# EAGLE design main (EAGLE 6.4)

## Sheet 1 of 2
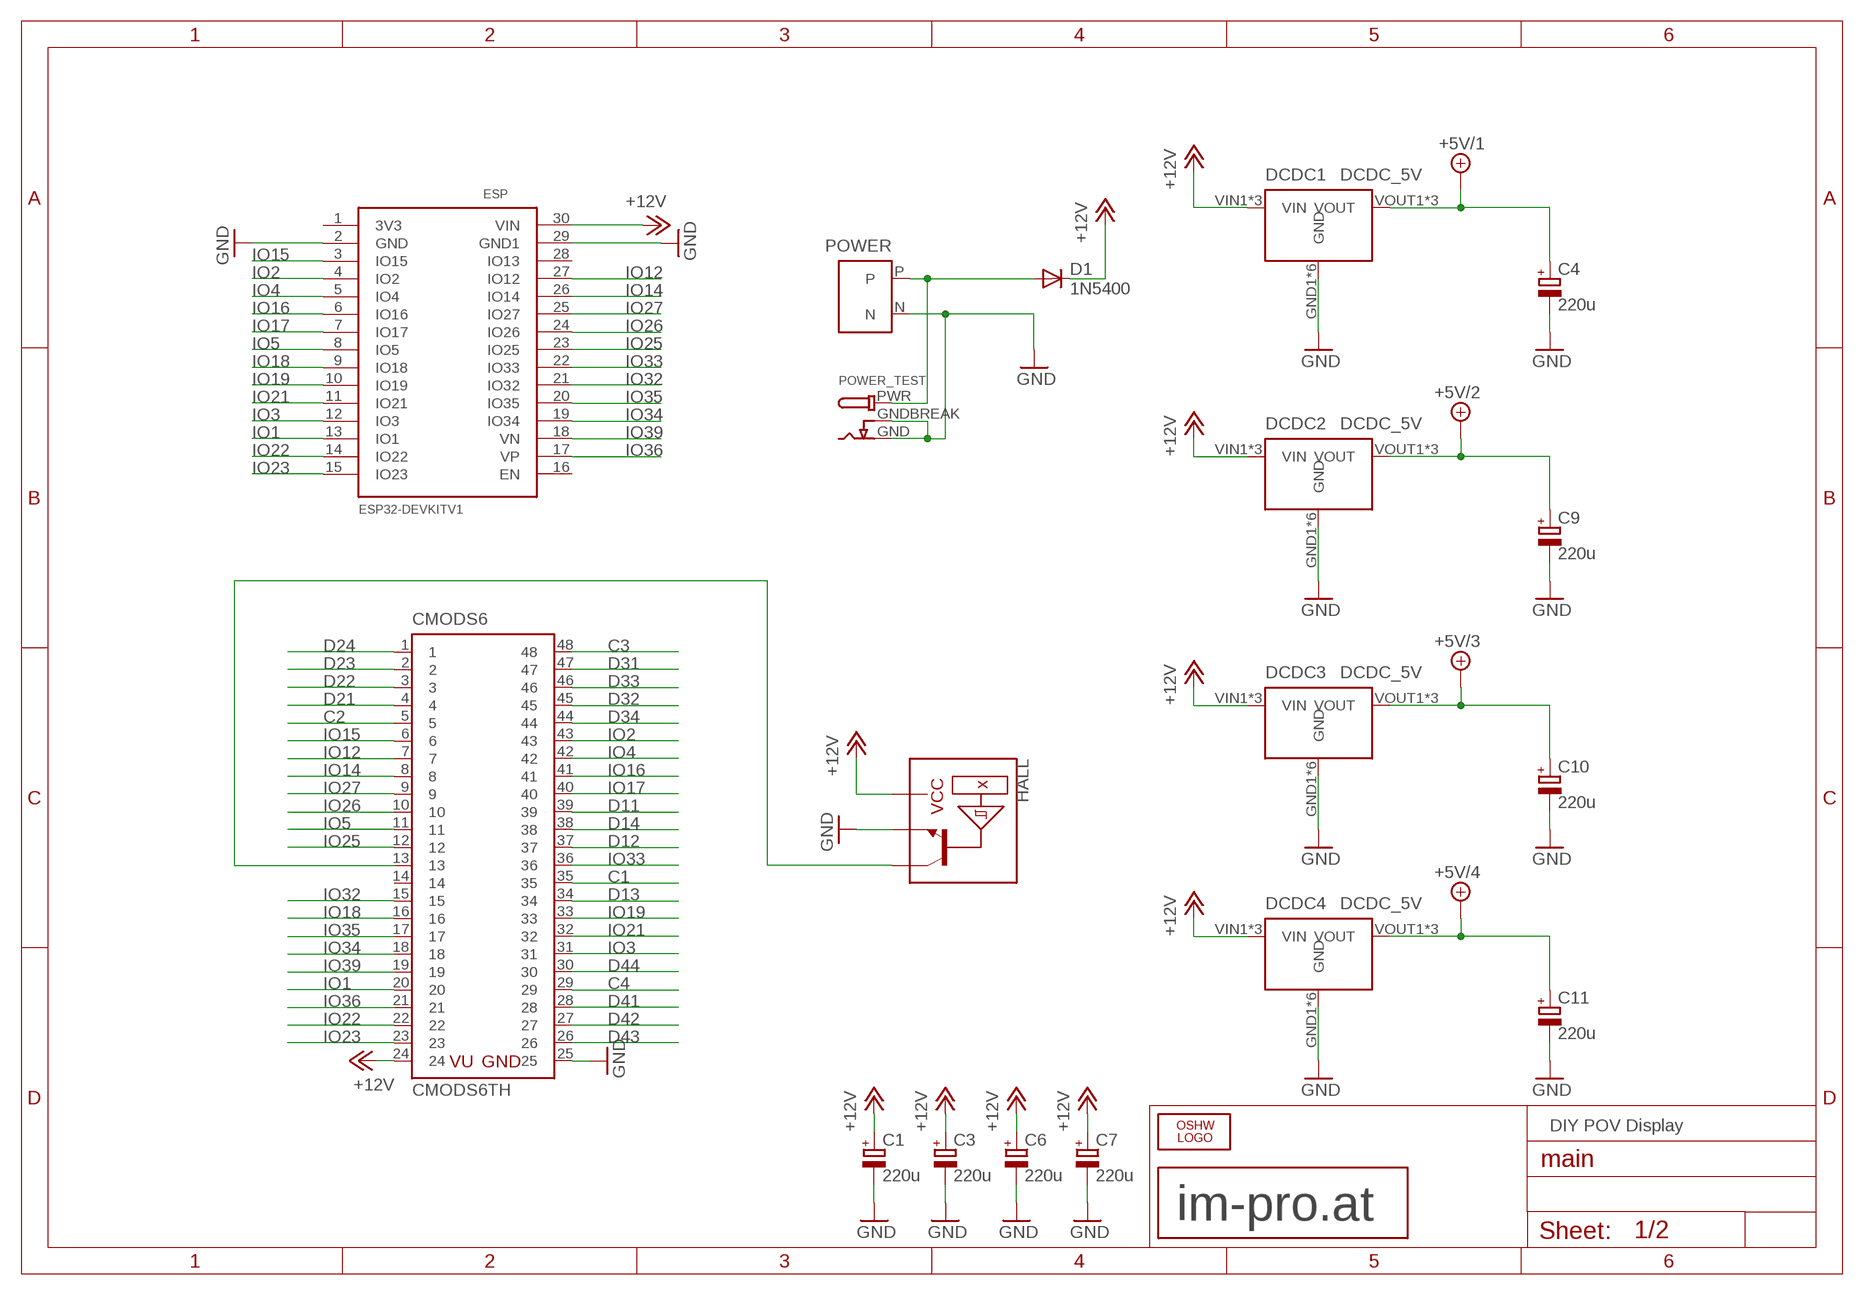
[diagram p0: schematic, sheet 1]

### Parts
C1  220u  CPOL-EUE3.5-8  [E3,5-8]
C3  220u  CPOL-EUE3.5-8  [E3,5-8]
C4  220u  CPOL-EUE3.5-8  [E3,5-8]
C6  220u  CPOL-EUE3.5-8  [E3,5-8]
C7  220u  CPOL-EUE3.5-8  [E3,5-8]
C9  220u  CPOL-EUE3.5-8  [E3,5-8]
C10  220u  CPOL-EUE3.5-8  [E3,5-8]
C11  220u  CPOL-EUE3.5-8  [E3,5-8]
CMODS6  CMODS6TH  [DIL48]
D1  1N5400  [DO201-15]
DCDC1  DCDC_5V  [DCDC]
DCDC2  DCDC_5V  [DCDC]
DCDC3  DCDC_5V  [DCDC]
DCDC4  DCDC_5V  [DCDC]
ESP  ESP32DEVKITV1  [ESP32-DEVKITV1]
HALL  HALL  [HALL]
LOGO1  OSHW_LOGO_FILLX0350-NT  [OSHW_FILLX350_NOTEXT]
POWER  TX30  [XT30]
POWER_TEST  DCBARRELPTH  [DCJACK_2MM_PTH]
U$2  LOGO20MM  [LOGO_20MM]

### Nets
+5V/1: C4.+ DCDC1.VOUT1(VOUT) DCDC1.VOUT2(VOUT) DCDC1.VOUT3(VOUT) ; also sheet 2
+5V/2: C9.+ DCDC2.VOUT1(VOUT) DCDC2.VOUT2(VOUT) DCDC2.VOUT3(VOUT) ; also sheet 2
+5V/3: C10.+ DCDC3.VOUT1(VOUT) DCDC3.VOUT2(VOUT) DCDC3.VOUT3(VOUT) ; also sheet 2
+5V/4: C11.+ DCDC4.VOUT1(VOUT) DCDC4.VOUT2(VOUT) DCDC4.VOUT3(VOUT) ; also sheet 2
+12V: C1.+ C3.+ C6.+ C7.+ CMODS6.24 D1.C DCDC1.VIN1(VIN) DCDC1.VIN2(VIN) DCDC1.VIN3(VIN) DCDC2.VIN1(VIN) DCDC2.VIN2(VIN) DCDC2.VIN3(VIN) DCDC3.VIN1(VIN) DCDC3.VIN2(VIN) DCDC3.VIN3(VIN) DCDC4.VIN1(VIN) DCDC4.VIN2(VIN) DCDC4.VIN3(VIN) ESP.30(VIN) HALL.VCC
C1: CMODS6.35 ; also sheet 2
C2: CMODS6.5 ; also sheet 2
C3: CMODS6.48 ; also sheet 2
C4: CMODS6.29 ; also sheet 2
D11: CMODS6.39 ; also sheet 2
D12: CMODS6.37 ; also sheet 2
D13: CMODS6.34 ; also sheet 2
D14: CMODS6.38 ; also sheet 2
D21: CMODS6.4 ; also sheet 2
D22: CMODS6.3 ; also sheet 2
D23: CMODS6.2 ; also sheet 2
D24: CMODS6.1 ; also sheet 2
D31: CMODS6.47 ; also sheet 2
D32: CMODS6.45 ; also sheet 2
D33: CMODS6.46 ; also sheet 2
D34: CMODS6.44 ; also sheet 2
D41: CMODS6.28 ; also sheet 2
D42: CMODS6.27 ; also sheet 2
D43: CMODS6.26 ; also sheet 2
D44: CMODS6.30 ; also sheet 2
GND: C1.- C3.- C4.- C6.- C7.- C9.- C10.- C11.- CMODS6.25 DCDC1.GND1(GND) DCDC1.GND2(GND) DCDC1.GND3(GND) DCDC1.GND4(GND) DCDC1.GND5(GND) DCDC1.GND6(GND) DCDC2.GND1(GND) DCDC2.GND2(GND) DCDC2.GND3(GND) DCDC2.GND4(GND) DCDC2.GND5(GND) DCDC2.GND6(GND) DCDC3.GND1(GND) DCDC3.GND2(GND) DCDC3.GND3(GND) DCDC3.GND4(GND) DCDC3.GND5(GND) DCDC3.GND6(GND) DCDC4.GND1(GND) DCDC4.GND2(GND) DCDC4.GND3(GND) DCDC4.GND4(GND) DCDC4.GND5(GND) DCDC4.GND6(GND) ESP.2(GND) ESP.29(GND1) HALL.GND POWER.N POWER_TEST.GND POWER_TEST.GNDBREAK ; also sheet 2
IO1: CMODS6.20 ESP.13(IO1)
IO2: CMODS6.43 ESP.4(IO2)
IO3: CMODS6.31 ESP.12(IO3)
IO4: CMODS6.42 ESP.5(IO4)
IO5: CMODS6.11 ESP.8(IO5)
IO12: CMODS6.7 ESP.27(IO12)
IO14: CMODS6.8 ESP.26(IO14)
IO15: CMODS6.6 ESP.3(IO15)
IO16: CMODS6.41 ESP.6(IO16)
IO17: CMODS6.40 ESP.7(IO17)
IO18: CMODS6.16 ESP.9(IO18)
IO19: CMODS6.33 ESP.10(IO19)
IO21: CMODS6.32 ESP.11(IO21)
IO22: CMODS6.22 ESP.14(IO22)
IO23: CMODS6.23 ESP.15(IO23)
IO25: CMODS6.12 ESP.23(IO25)
IO26: CMODS6.10 ESP.24(IO26)
IO27: CMODS6.9 ESP.25(IO27)
IO32: CMODS6.15 ESP.21(IO32)
IO33: CMODS6.36 ESP.22(IO33)
IO34: CMODS6.18 ESP.19(IO34)
IO35: CMODS6.17 ESP.20(IO35)
IO36: CMODS6.21 ESP.17(VP)
IO39: CMODS6.19 ESP.18(VN)
N$1: CMODS6.13 HALL.OUT
N$26: D1.A POWER.P POWER_TEST.PWR
Unconnected: CMODS6.14 ESP.1(3V3) ESP.16(EN) ESP.28(IO13)

### Notes on the sheet
- DIY POV Display

## Sheet 2 of 2
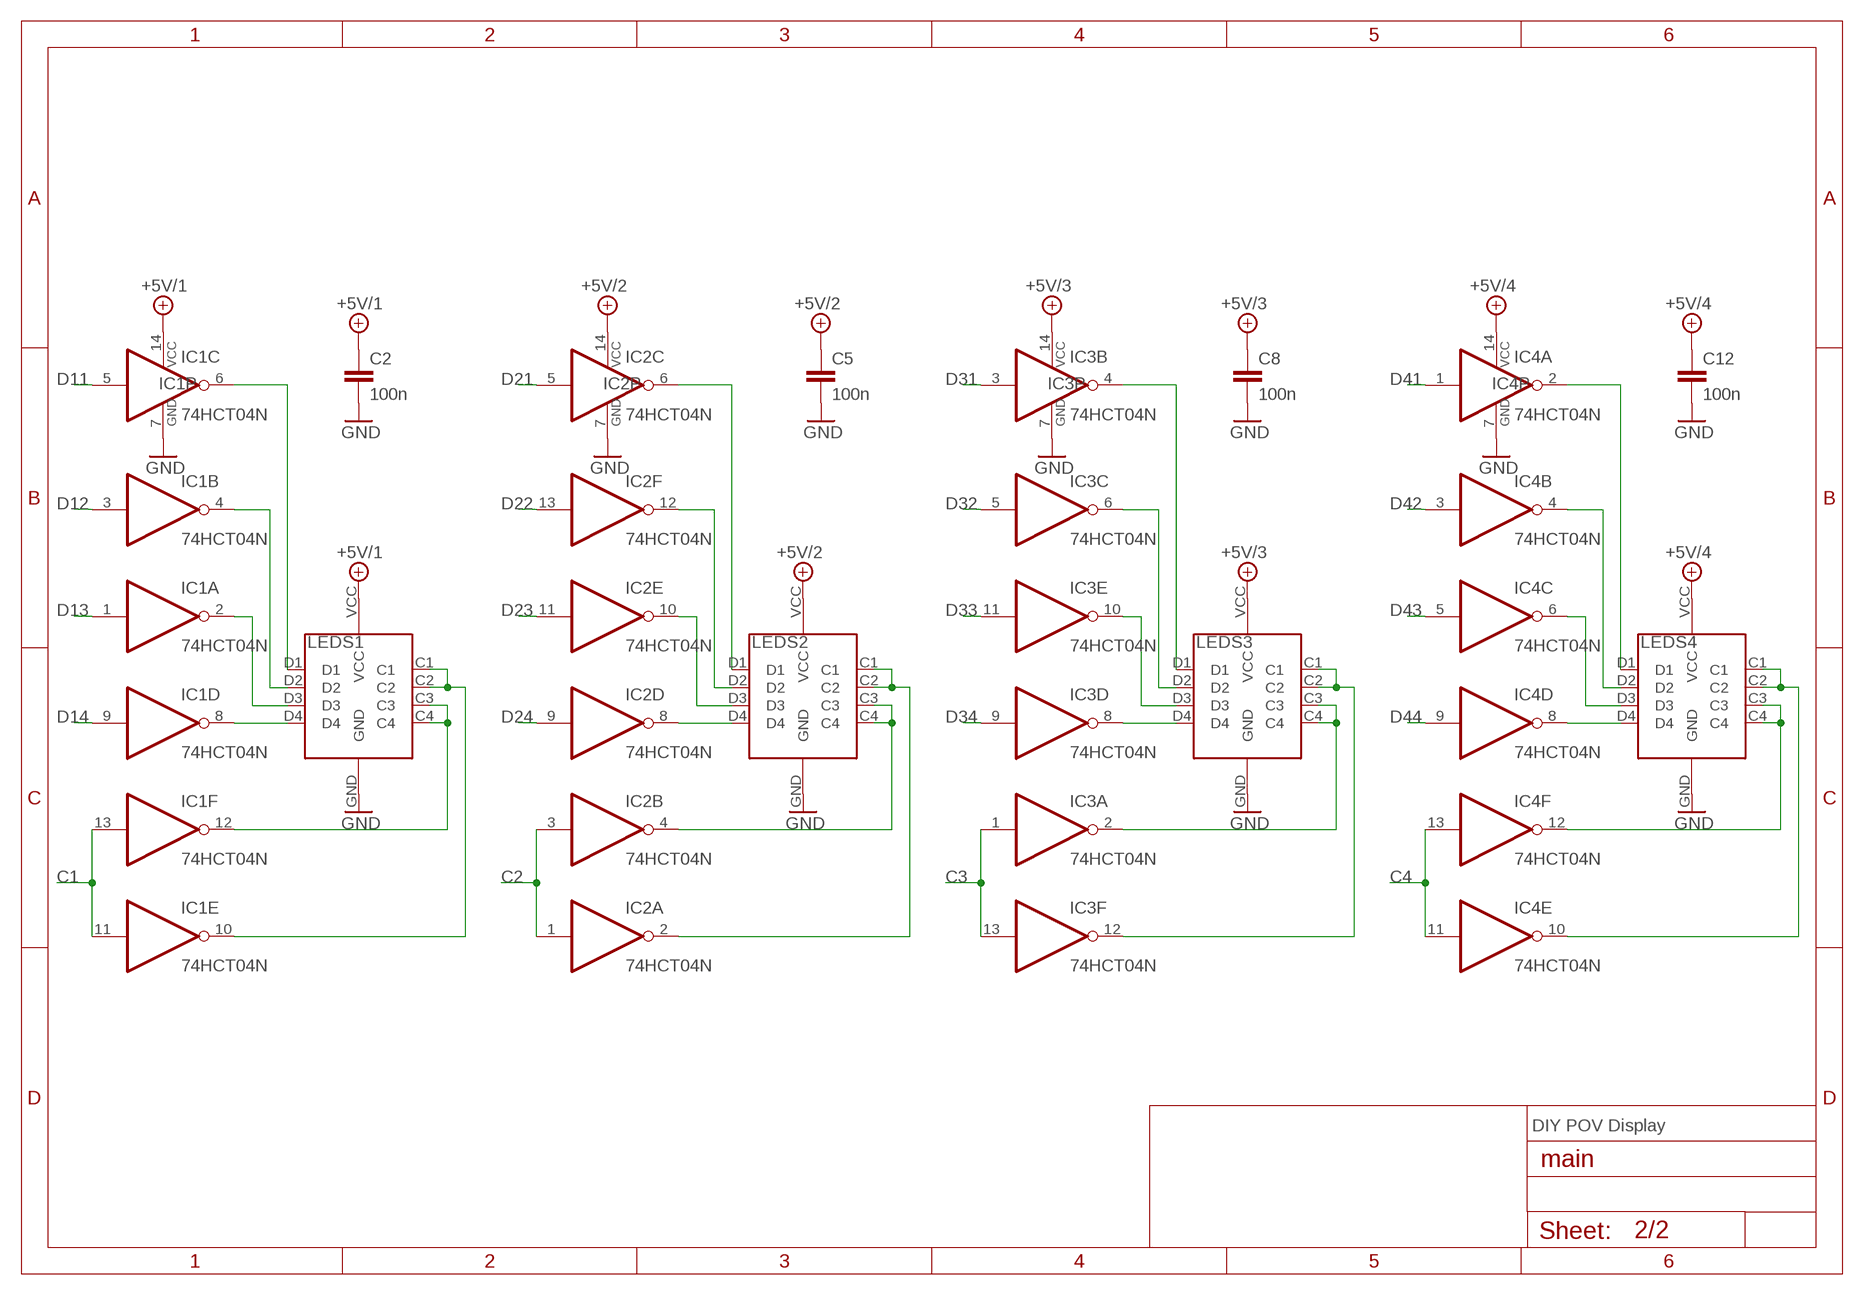
[diagram p1: schematic, sheet 2]

### Parts
C2  100n  C-EU025_050-025X075  [C025_050-025X075]
C5  100n  C-EU025_050-025X075  [C025_050-025X075]
C8  100n  C-EU025_050-025X075  [C025_050-025X075]
C12  100n  C-EU025_050-025X075  [C025_050-025X075]
IC1  74HCT04N  [DIL14]
IC2  74HCT04N  [DIL14]
IC3  74HCT04N  [DIL14]
IC4  74HCT04N  [DIL14]
LEDS1  LEDCON  [LEDCON]
LEDS2  LEDCON  [LEDCON]
LEDS3  LEDCON  [LEDCON]
LEDS4  LEDCON  [LEDCON]

### Nets
+5V/1: C2.1 IC1.14(P:VCC) LEDS1.VCC ; also sheet 1
+5V/2: C5.1 IC2.14(P:VCC) LEDS2.VCC ; also sheet 1
+5V/3: C8.1 IC3.14(P:VCC) LEDS3.VCC ; also sheet 1
+5V/4: C12.1 IC4.14(P:VCC) LEDS4.VCC ; also sheet 1
C1: IC1.11(E:I) IC1.13(F:I) ; also sheet 1
C2: IC2.1(A:I) IC2.3(B:I) ; also sheet 1
C3: IC3.1(A:I) IC3.13(F:I) ; also sheet 1
C4: IC4.11(E:I) IC4.13(F:I) ; also sheet 1
D11: IC1.5(C:I) ; also sheet 1
D12: IC1.3(B:I) ; also sheet 1
D13: IC1.1(A:I) ; also sheet 1
D14: IC1.9(D:I) ; also sheet 1
D21: IC2.5(C:I) ; also sheet 1
D22: IC2.13(F:I) ; also sheet 1
D23: IC2.11(E:I) ; also sheet 1
D24: IC2.9(D:I) ; also sheet 1
D31: IC3.3(B:I) ; also sheet 1
D32: IC3.5(C:I) ; also sheet 1
D33: IC3.11(E:I) ; also sheet 1
D34: IC3.9(D:I) ; also sheet 1
D41: IC4.1(A:I) ; also sheet 1
D42: IC4.3(B:I) ; also sheet 1
D43: IC4.5(C:I) ; also sheet 1
D44: IC4.9(D:I) ; also sheet 1
GND: C2.2 C2.3 C5.2 C5.3 C8.2 C8.3 C12.2 C12.3 IC1.7(P:GND) IC2.7(P:GND) IC3.7(P:GND) IC4.7(P:GND) LEDS1.GND LEDS2.GND LEDS3.GND LEDS4.GND ; also sheet 1
N$2: IC1.8(D:O) LEDS1.D4
N$3: IC1.2(A:O) LEDS1.D3
N$4: IC1.4(B:O) LEDS1.D2
N$5: IC1.6(C:O) LEDS1.D1
N$6: IC1.12(F:O) LEDS1.C3 LEDS1.C4
N$7: IC1.10(E:O) LEDS1.C1 LEDS1.C2
N$8: IC2.8(D:O) LEDS2.D4
N$9: IC2.10(E:O) LEDS2.D3
N$10: IC2.12(F:O) LEDS2.D2
N$11: IC2.6(C:O) LEDS2.D1
N$12: IC2.4(B:O) LEDS2.C3 LEDS2.C4
N$13: IC2.2(A:O) LEDS2.C1 LEDS2.C2
N$14: IC3.8(D:O) LEDS3.D4
N$15: IC3.10(E:O) LEDS3.D3
N$16: IC3.6(C:O) LEDS3.D2
N$17: IC3.4(B:O) LEDS3.D1
N$18: IC3.2(A:O) LEDS3.C3 LEDS3.C4
N$19: IC3.12(F:O) LEDS3.C1 LEDS3.C2
N$20: IC4.8(D:O) LEDS4.D4
N$21: IC4.6(C:O) LEDS4.D3
N$22: IC4.4(B:O) LEDS4.D2
N$23: IC4.2(A:O) LEDS4.D1
N$24: IC4.12(F:O) LEDS4.C3 LEDS4.C4
N$25: IC4.10(E:O) LEDS4.C1 LEDS4.C2

### Notes on the sheet
- DIY POV Display

## Library data of the parts
C1 C3 C4 C6 C7 C9-C11 = rcl:CPOL-EU: POLARIZED CAPACITOR, European symbol
C2 C5 C8 C12 = rcl:C-EU: CAPACITOR, European symbol
CMODS6 = diypov:CMODS6
D1 = diode:1N5400: DIODE standard rectifier, 3 A, 50 V (Motorola)
DCDC1-DCDC4 = diypov:DCDC_5V
ESP = ESP32-DEVKITV1:ESP32DEVKITV1
HALL = diypov:HALL
IC1-IC4 = 74xx-eu:74*04: Hex INVERTER
LEDS1-LEDS4 = diypov:LEDCON
LOGO1 = ohw-logo:OSHW_LOGO_FILL
POWER = diypov:TX30
POWER_TEST = microbuilder:DCBARREL: DC Barrel Jack DCJACK_1.3MM_PTH - Through Hole 1.3mm Jack (4UConnector: 05536) DCJACK_2MM_PTH - Through Hole 2.0/2.1 Jack (4UConnector: 05537) DCJACK_2MM_SMT - SMT 2.0/2.1mm Jack(4UConnector: 03267)
U$2 = im-pro-logo:LOGO

## Board
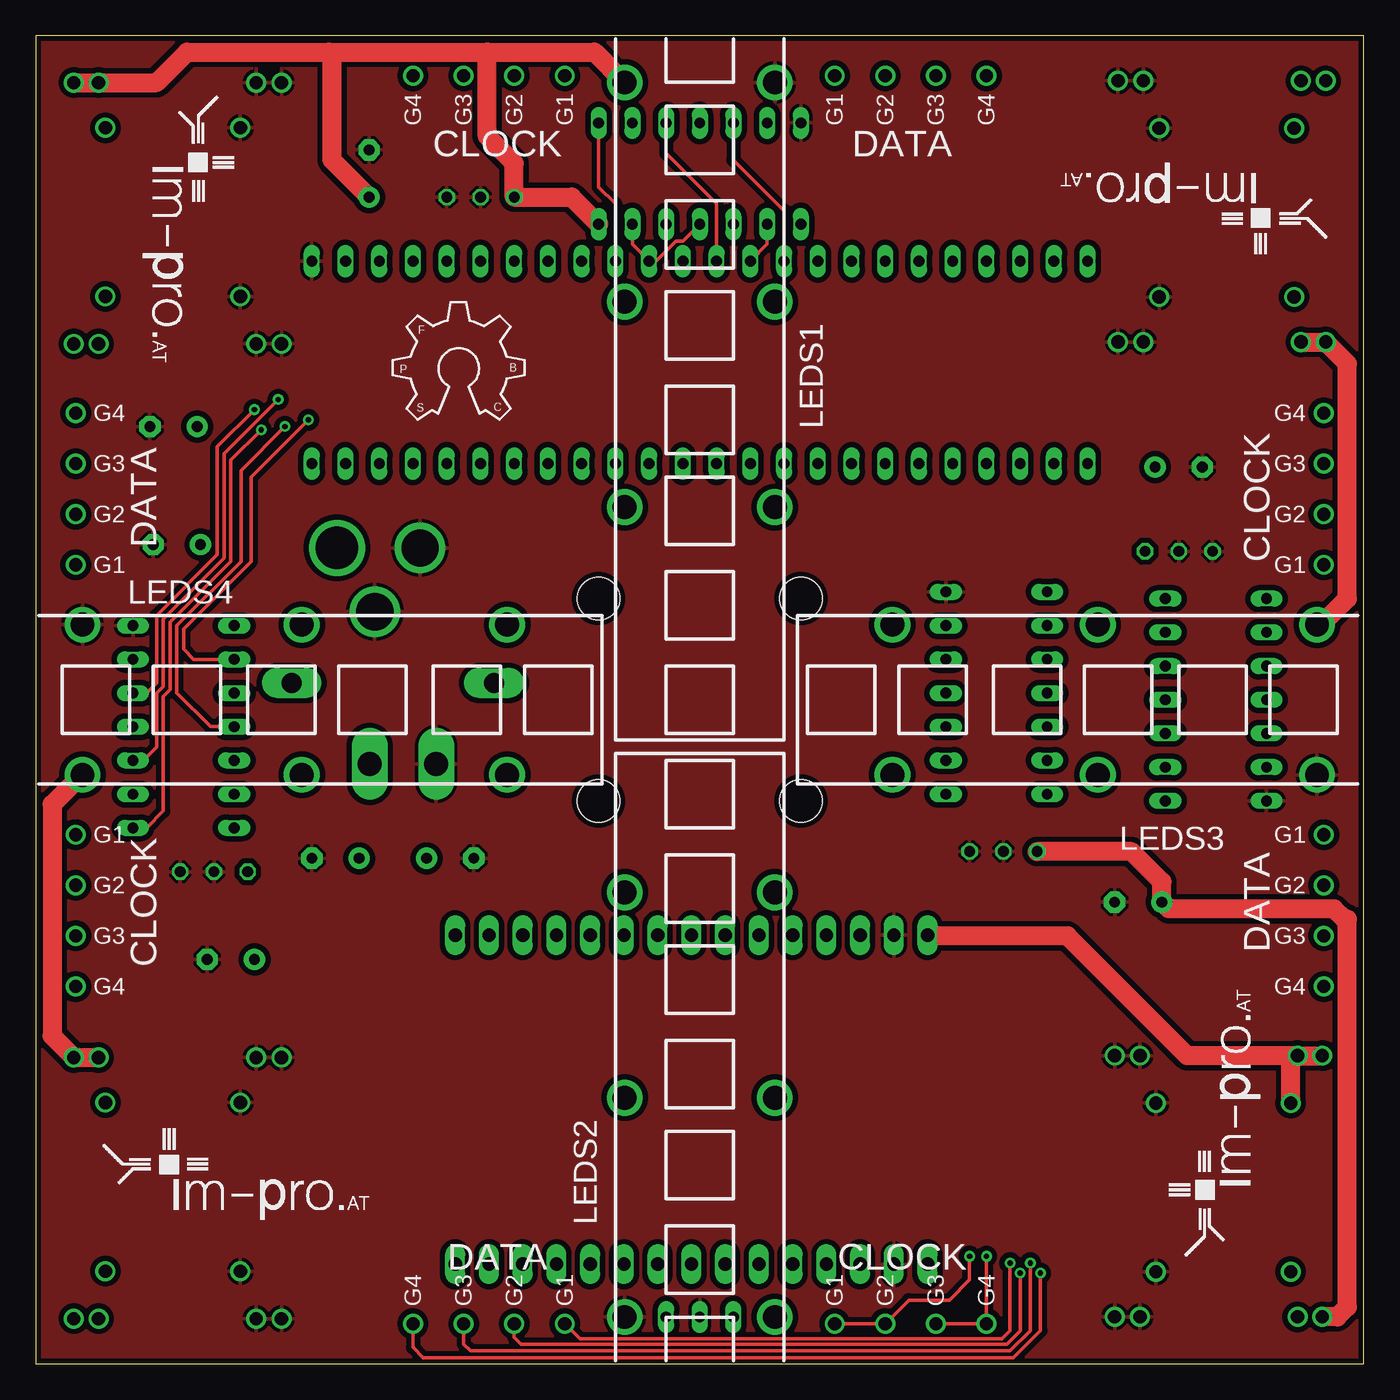
[diagram p2: board, top side]
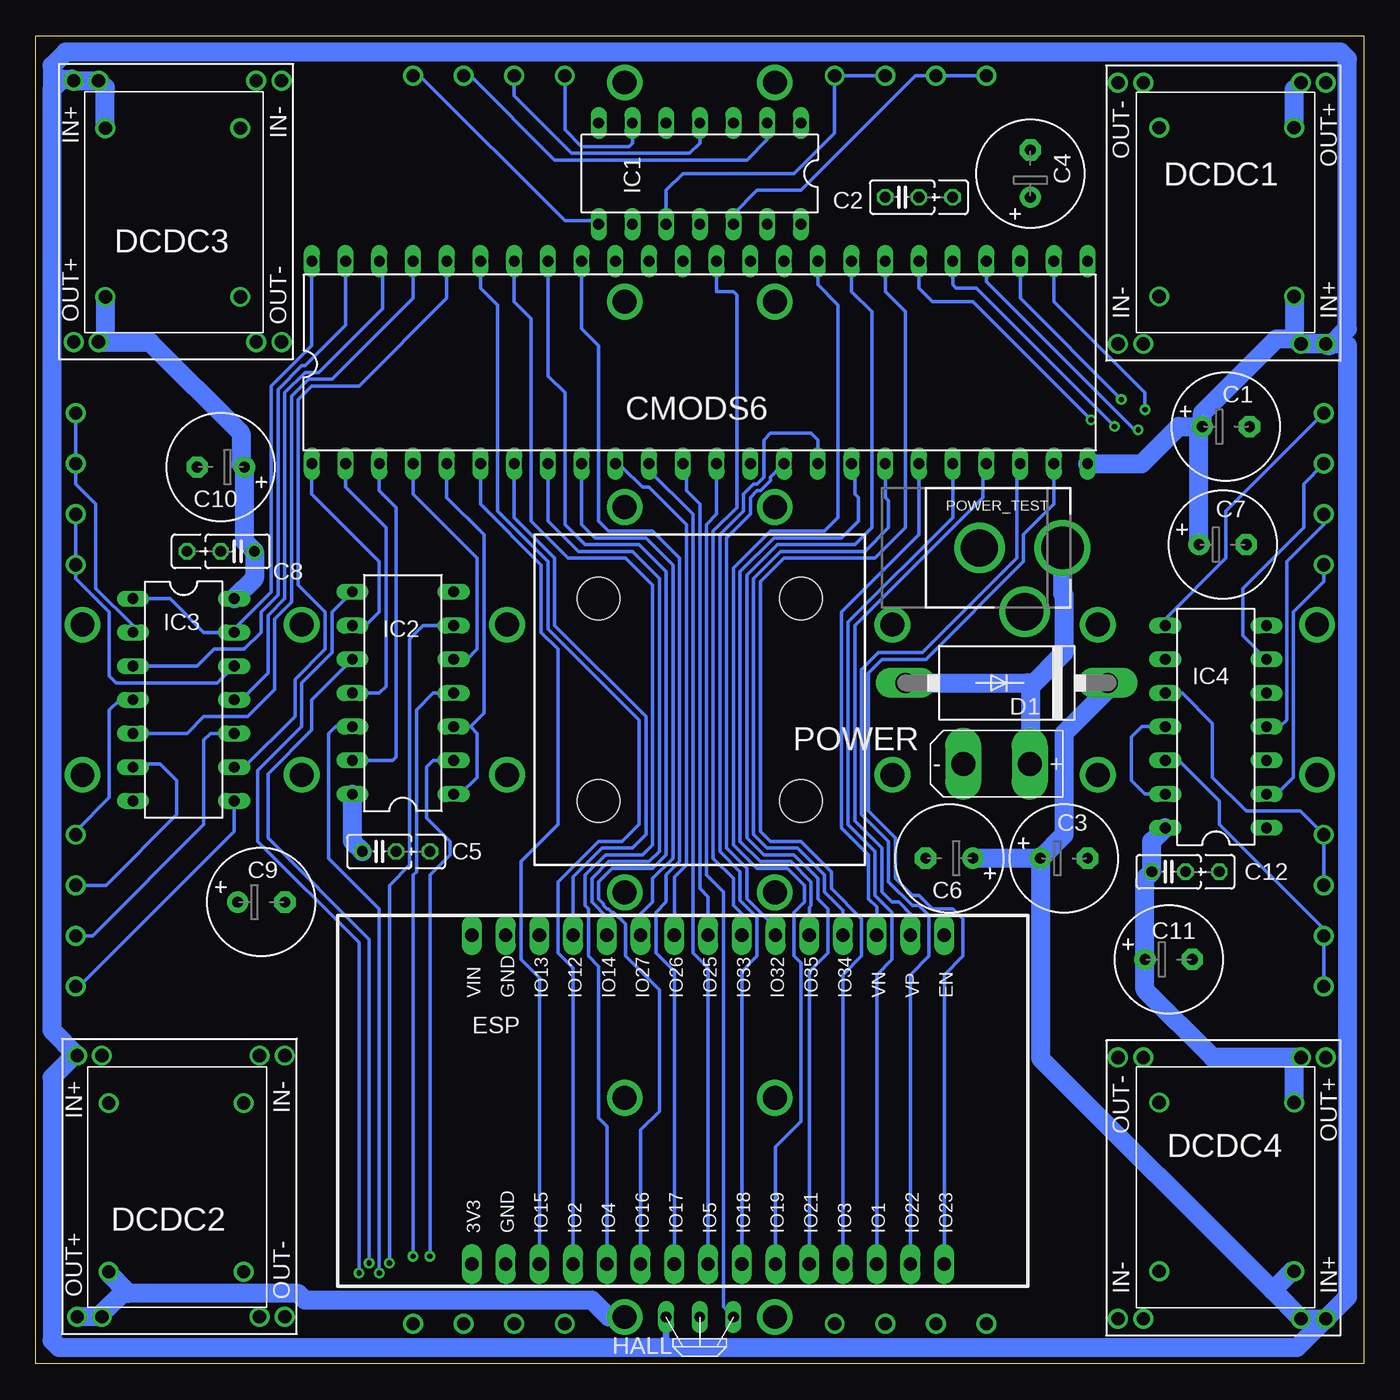
[diagram p3: board, bottom side, seen from below]

Size 100 x 100 mm. Coordinates in mm from the lower left corner, seen from the top.
Outline: 0,0 100,0 100,100 0,100 0,0
Copper layers (1*16): Top 0.035559375mm / dielectric 1.6mm / Bottom 0.035559375mm
Design rules "jlcpcb2layer": minimum track width 5mil, minimum drill 12mil, track to track 5mil, track to pad 5mil, pad to pad 5mil, via to via 5mil, smd to smd 5mil, copper to edge 8mil, drill to drill 6mil, minimum pad ring 5mil, minimum via ring 3mil, stop-mask expansion 2.5mil, vias tented up to drill 0mil, thermal gap 10mil
Holes 3.2 mm at 42.38,57.62 57.62,57.62 57.62,42.38 42.38,42.38
tKeepout: area 39.6,39.6 to 45.1,45.1

### Footprints (pad centres in the part's own frame; a part is rotated, then mirrored left to right if it is on the bottom)
E3,5-8 = drill 0.813 pad 1.6: + -1.778,0 | drill 0.813 pad 1.6 octagon: - 1.778,0
C025_050-025X075 = drill 0.813 octagon: 1 -1.27,0; 2 1.27,0; 3 3.81,0
DIL48 = drill 0.813 long: 1 -29.21,-7.62; 2 -26.67,-7.62; 3 -24.13,-7.62; 4 -21.59,-7.62; 5 -19.05,-7.62; 6 -16.51,-7.62; 7 -13.97,-7.62; 8 -11.43,-7.62; 9 -8.89,-7.62; 10 -6.35,-7.62; 11 -3.81,-7.62; 12 -1.27,-7.62; 13 1.27,-7.62; 14 3.81,-7.62; 15 6.35,-7.62; 16 8.89,-7.62; 17 11.43,-7.62; 18 13.97,-7.62; 19 16.51,-7.62; 20 19.05,-7.62; 21 21.59,-7.62; 22 24.13,-7.62; 23 26.67,-7.62; 24 29.21,-7.62; 25 29.21,7.62; 26 26.67,7.62; 27 24.13,7.62; 28 21.59,7.62; 29 19.05,7.62; 30 16.51,7.62; 31 13.97,7.62; 32 11.43,7.62; 33 8.89,7.62; 34 6.35,7.62; 35 3.81,7.62; 36 1.27,7.62; 37 -1.27,7.62; 38 -3.81,7.62; 39 -6.35,7.62; 40 -8.89,7.62; 41 -11.43,7.62; 42 -13.97,7.62; 43 -16.51,7.62; 44 -19.05,7.62; 45 -21.59,7.62; 46 -24.13,7.62; 47 -26.67,7.62; 48 -29.21,7.62
DO201-15 = drill 1.499 long: A 7.62,0; C -7.62,0
DCDC = drill 1: GND1 0.635,0; GND2 0.635,-1.905; GND3 20.305,0; GND4 20.305,-1.905; GND5 4.21,-3.1; GND6 16.91,-3.1; VIN1 0.635,-13.775; VIN2 0.635,-15.64; VIN3 4.21,-13.26; VOUT1 20.305,-13.775; VOUT2 20.305,-15.64; VOUT3 16.91,-13.26
ESP32-DEVKITV1 = drill 1 long: 1 -22.87,-13.54; 2 -20.33,-13.54; 3 -17.79,-13.54; 4 -15.25,-13.54; 5 -12.71,-13.54; 6 -10.17,-13.54; 7 -7.63,-13.54; 8 -5.09,-13.54; 9 -2.55,-13.54; 10 -0.01,-13.54; 11 2.53,-13.54; 12 5.07,-13.54; 13 7.61,-13.54; 14 10.15,-13.54; 15 12.69,-13.54; 16 12.69,11.23; 17 10.15,11.23; 18 7.61,11.23; 19 5.07,11.23; 20 2.53,11.23; 21 -0.01,11.23; 22 -2.55,11.23; 23 -5.09,11.23; 24 -7.63,11.23; 25 -10.17,11.23; 26 -12.71,11.23; 27 -15.25,11.23; 28 -17.79,11.23; 29 -20.33,11.23; 30 -22.87,11.23
HALL = drill 0.813 long: GND 0,0; OUT 2.54,0; VCC -2.54,0
DIL14 = drill 0.813 long: 1 -7.62,-3.81; 2 -5.08,-3.81; 3 -2.54,-3.81; 4 0,-3.81; 5 2.54,-3.81; 6 5.08,-3.81; 7 7.62,-3.81; 8 7.62,3.81; 9 5.08,3.81; 10 2.54,3.81; 11 0,3.81; 12 -2.54,3.81; 13 -5.08,3.81; 14 -7.62,3.81
LEDCON = drill 1: C1 46.99,10.16; C2 46.99,13.97; C3 46.99,17.78; C4 46.99,21.59; D1 46.99,-10.16; D2 46.99,-13.97; D3 46.99,-17.78; D4 46.99,-21.59 | drill 1.8: GND 46.48,-5.65; NC1 14.5,5.65; NC2 14.5,-5.65; NC3 29.97,5.65; NC4 29.97,-5.65; VCC 46.48,5.65
XT30 = drill 1.8 long: N 2.5,0; P -2.5,0
DCJACK_2MM_PTH = drill 2.8: GND 0,7.35; GNDBREAK 4.8,10.75 | drill 3.2: PWR 0,13.6

### Placement (x,y rotation side)
C1  10.38,70.57 0 bottom
C2  34.76,87.85 0 bottom
C3  22.57,38.06 0 bottom
C4  25.11,89.62 90 bottom
C5  74.13,38.57 0 bottom
C6  31.2,38.06 180 bottom
C7  10.63,61.68 0 bottom
C8  84.8,61.18 180 bottom
C9  83.02,34.76 0 bottom
C10  86.07,67.53 180 bottom
C11  14.69,30.44 0 bottom
C12  14.69,37.05 0 bottom
CMODS6  50,75.4 0 bottom
D1  26.89,51.27 180 bottom
DCDC1  18.5,76.16 90 bottom
DCDC2  81.24,23.84 270 bottom
DCDC3  81.5,97.24 270 bottom
DCDC4  18.5,2.76 90 bottom
ESP  44.28,21.04 0 bottom
HALL  50,3.52 0 bottom
IC1  50,89.62 180 bottom
IC2  72.35,50.51 90 bottom
IC3  88.86,50 270 bottom
IC4  11.14,47.97 90 bottom
LEDS1  50,50 90 top
LEDS2  50,50 270 top
LEDS3  50,50 0 top
LEDS4  50,50 180 top
LOGO1  26.89,71.08 0 top
POWER  27.65,45.17 180 bottom
POWER_TEST  36.28,61.43 270 bottom
U$1  LOGO20MM  [LOGO_20MM]  5.04,10.38 0 top
U$2  92.67,8.09 90 top
U$3  LOGO20MM  [LOGO_20MM]  7.58,95.47 270 top
U$4  LOGO20MM  [LOGO_20MM]  97.24,90.89 180 top

### Tracks (layer width: path | path; a pad name or v marks a point on that pad's centre or on a via)
+5V/1
  Top 1.422: DCDC1.VOUT2 DCDC1.VOUT1 9.09,96.47 11.39,98.77 22.06,98.77 | 22.06,98.77 34,98.77 | 34,98.77 42.06,98.77 LEDS1.VCC | C4.+ 22.31,90.64 22.31,98.51 22.06,98.77 | IC1.14 40.35,87.85 C2.1 36.03,90.39 34,92.42 34,98.77
  Bottom 1.422: DCDC1.VOUT3 5.24,95.95 DCDC1.VOUT1
+5V/2
  Top 1.422: C5.1 82.51,38.57 84.8,36.28 C9.+ 85.31,34.25 97.75,34.25 98.51,33.49 98.77,33.49 98.77,4.28 98.02,3.53 DCDC2.VOUT2
  Bottom 1.422: LEDS2.VCC 56.86,3.52 58.13,4.79 79.72,4.79 80.23,5.3 93,5.3 93.25,5.55 | IC2.14 76.16,39.33 C5.1 | 93.25,5.55 95.02,3.79 DCDC2.VOUT1 DCDC2.VOUT2 | DCDC2.VOUT3 94.5,6.8 93.25,5.55
+5V/3
  Top 1.422: DCDC3.VOUT1 DCDC3.VOUT2 98.77,75.31 98.77,57.62 96.8,55.65 LEDS3.VCC
  Bottom 1.422: IC3.14 83.53,59.14 C8.1 84.29,61.94 C10.+ 84.54,67.78 84.54,70.07 91.42,76.94 DCDC3.VOUT1 94.76,77.45 DCDC3.VOUT3
+5V/4
  Top 1.422: DCDC4.VOUT1 DCDC4.VOUT2 1.23,24.69 1.23,42.13 3.46,44.35 LEDS4.VCC
  Bottom 1.422: IC4.14 15.96,39.33 C12.1 16.47,36.54 C11.+ 16.47,28.16 11.38,23.06 DCDC4.VOUT1 5.24,22.55 DCDC4.VOUT3
+12V  (1 unrouted)
  Top 1.422: ESP.30 67.21,32.22 77.69,32.22 86.7,23.2 DCDC2.VIN1 | DCDC2.VIN3 94.5,22.69 DCDC2.VIN1 | DCDC2.VIN1 DCDC2.VIN2
  Bottom 0.5: HALL.VCC 52.54,1.74 52.03,1.23
  Bottom 1.422: D1.C 19.27,50.76 22.57,47.46 22.57,39.84 C3.+ | C3.+ C6.+ | C3.+ 24.35,23.01 6.85,5.52 | 6.85,5.52 DCDC4.VIN1 DCDC4.VIN2 | DCDC1.VIN2 DCDC1.VIN1 | DCDC1.VIN1 1.36,76.8 1.23,76.67 1.23,5.02 DCDC4.VIN2 | 97.14,23.18 98.77,21.55 98.77,1.74 98.26,1.23 52.03,1.23 5.02,1.23 DCDC4.VIN2 | 96.86,23.2 98.77,25.11 98.77,95.97 | 98.77,95.97 98.01,96.74 97.26,96.74 DCDC3.VIN2 DCDC3.VIN1 94.76,96.09 DCDC3.VIN3 | DCDC1.VIN1 2.88,76.8 2.76,76.67 2.5,76.67 1.23,77.94 1.23,98.26 1.74,98.77 97.75,98.77 98.77,97.75 98.77,95.97 | CMODS6.24 16.73,67.78 13.93,70.57 C1.+ | C7.+ 12.41,70.32 C1.+ | C1.+ 12.15,71.59 6.57,77.18 5.11,77.18 DCDC1.VIN1 | DCDC1.VIN3 5.24,77.31 DCDC1.VIN1 | DCDC4.VIN3 5.4,6.97 6.85,5.52
C1
  Top 0.254: IC1.13 44.92,84.29 CMODS6.35 46.7,83.02 48.22,84.54 48.73,84.54 IC1.11
C2
  Bottom 0.254: IC2.1 68.03,42.89 66.76,44.16 66.76,47.46 67.27,47.97 | IC2.3 67.27,47.97 | 67.27,47.97 66.26,48.98 66.26,62.45 69.05,65.24 CMODS6.5
C3
  Bottom 0.254: IC3.1 89.88,57.62 87.34,55.08 IC3.13 85.05,55.33 82.26,58.13 82.26,73.62 79.21,76.67 CMODS6.48
C4  (via drill 0.4 pad 0.8)
  Top 0.254: IC4.11 13.17,47.97 10.63,50.51 10.63,55.59 15.46,60.41 15.46,67.27 v18.76,70.57
  Bottom 0.254: IC4.13 16.47,42.89 17.49,43.9 17.49,47.21 16.73,47.97 IC4.11 | v18.76,70.57 29.17,80.99 30.7,80.99 30.95,81.24 CMODS6.29
D11
  Top 0.254: IC1.5 52.54,90.64 56.35,86.83 CMODS6.39
D12
  Top 0.254: IC1.3 47.46,91.15 51.27,87.34 CMODS6.37
D13
  Top 0.254: IC1.1 42.38,88.61 43.65,87.34 CMODS6.34
D14
  Top 0.254: IC1.9 55.08,84.29 CMODS6.38
D21
  Bottom 0.254: IC2.5 67.53,53.05 66.76,53.81 66.76,60.67 71.59,65.49 CMODS6.4
D22
  Bottom 0.254: IC2.13 73.11,45.43 72.86,45.68 72.86,64.48 74.13,65.75 CMODS6.3
D23
  Bottom 0.254: IC2.11 74.13,50.51 73.62,51.02 73.62,62.95 76.67,66 CMODS6.2
D24
  Bottom 0.254: IC2.9 75.15,55.59 74.13,56.6 74.13,60.41 79.21,65.49 CMODS6.1
D31
  Bottom 0.254: IC3.3 87.85,52.54 86.58,53.81 84.29,53.81 83.02,55.08 83.02,56.6 81.75,57.87 81.75,73.37 79.97,75.15 79.72,75.15 76.67,78.19 CMODS6.47
D32
  Bottom 0.254: IC3.5 88.61,47.46 87.34,48.73 84.04,48.73 82,50.76 82,56.1 80.73,57.37 80.73,72.86 79.46,74.13 77.69,74.13 71.59,80.23 CMODS6.45
D33
  Bottom 0.254: IC3.11 84.54,50 82.51,52.03 82.51,56.35 81.24,57.62 81.24,73.11 79.72,74.64 78.7,74.64 73.88,79.46 73.88,82.77 CMODS6.46
D34
  Bottom 0.254: IC3.9 84.29,44.92 80.48,48.73 80.48,51.52 78.19,53.81 78.19,56.6 80.23,58.64 80.23,72.61 79.21,73.62 75.65,73.62 69.05,80.23 CMODS6.44
D41  (via drill 0.4 pad 0.8)
  Top 0.254: IC4.1 8.34,40.35 9.61,41.62 9.61,50.25 10.12,50.76 10.12,55.84 14.69,60.41 14.69,68.03 v16.98,70.32
  Bottom 0.254: v16.98,70.32 17.23,70.32 28.41,81.5 CMODS6.28
D42  (via drill 0.4 pad 0.8)
  Top 0.254: IC4.3 8.09,45.43 9.11,46.44 9.11,50.51 9.61,51.02 9.61,56.1 14.19,60.67 14.19,68.54 v18.25,72.61
  Bottom 0.254: v18.25,72.61 25.87,80.23 CMODS6.27
D43  (via drill 0.4 pad 0.8)
  Top 0.254: IC4.5 8.34,50.51 9.11,51.27 9.11,56.35 13.68,60.92 13.68,69.05 v16.47,71.84
  Bottom 0.254: v16.47,71.84 16.47,73.11 23.33,79.97 CMODS6.26
D44  (via drill 0.4 pad 0.8)
  Top 0.254: v20.54,71.08 16.22,66.76 16.22,60.41 11.14,55.33 11.14,53.81 11.9,53.05 IC4.9
  Bottom 0.254: v20.54,71.08 29.43,79.97 32.47,79.97 33.49,80.99 CMODS6.30
GND
  pour Top (isolate 0.4): 0.47,99.53 99.53,99.53 99.53,0.47 0.47,0.47
IO1
  Bottom 0.254: ESP.13 36.67,29.29 35.52,30.44 35.52,34 36.79,35.27 36.79,38.57 38.82,40.6 38.82,55.84 30.95,63.72 CMODS6.20
IO2
  Bottom 0.254: ESP.4 59.53,29.82 60.67,30.95 60.67,36.28 57.62,39.33 55.84,39.33 54.57,40.6 54.57,48.48 61.43,55.33 61.43,60.41 65.24,64.22 65.24,79.72 66.51,80.99 CMODS6.43
IO3
  Bottom 0.254: ESP.12 39.22,29.29 37.81,30.7 37.81,33.49 40.09,35.78 40.09,37.05 42.38,39.33 44.67,39.33 45.43,40.09 45.43,58.89 43.65,60.67 36.79,60.67 34.51,62.95 34.51,79.21 36.03,80.73 CMODS6.31
IO4
  Bottom 0.254: ESP.5 56.99,17.88 57.62,18.5 57.62,29.93 58.38,30.7 58.38,34.25 58.64,34.51 58.64,36.79 57.11,38.32 54.32,38.32 53.56,39.08 53.56,58.64 55.59,60.67 59.91,60.67 62.7,63.46 62.7,78.7 63.97,79.97 CMODS6.42
IO5
  Bottom 0.254: ESP.8 49.38,29.82 50.51,30.95 50.51,63.97 53.81,67.27 CMODS6.11
IO12
  Bottom 0.254: ESP.27 59.53,36.66 57.37,38.82 55.08,38.82 54.06,39.84 54.06,48.73 60.92,55.59 60.92,60.67 63.97,63.72 CMODS6.7
IO14
  Bottom 0.254: ESP.26 56.99,33.63 58.13,34.76 58.13,36.54 56.86,37.81 53.81,37.81 53.05,38.57 53.05,59.14 55.08,61.18 59.14,61.18 61.43,63.46 CMODS6.8
IO15
  Bottom 0.254: ESP.3 62.08,29.05 63.46,30.44 63.46,37.81 60.67,40.6 60.67,53.81 61.94,55.08 61.94,60.16 66.51,64.73 CMODS6.6
IO16
  Bottom 0.254: ESP.6 54.45,17.6 53.05,19.01 53.05,28.16 55.59,30.7 55.59,33.11 56.48,34 56.6,34 56.86,34.25 56.98,34.25 57.24,34.51 57.24,34.63 57.62,35.01 57.62,36.28 56.6,37.3 53.56,37.3 52.54,38.32 52.54,59.65 54.57,61.68 58.64,61.68 60.16,63.21 60.16,73.11 61.43,74.38 CMODS6.41
IO17
  Bottom 0.254: ESP.7 51.91,29.56 53.3,30.95 53.3,34 52.54,34.76 52.54,36.79 51.52,37.81 51.52,60.67 53.56,62.7 56.86,62.7 57.62,63.46 57.62,76.67 58.89,77.94 CMODS6.40
IO18
  Bottom 0.254: ESP.9 46.84,29.54 45.68,30.7 45.68,33.62 46.95,34.89 46.95,37.05 48.48,38.57 48.48,62.45 46.7,64.22 46.7,65.49 45.94,66.26 45.68,66.26 45.17,66.76 45.17,69.56 44.67,70.07 41.62,70.07 41.11,69.56 CMODS6.16
IO19
  Bottom 0.254: ESP.10 44.3,16.34 42.38,18.25 42.38,30.19 42.89,30.7 42.89,34 42.13,34.76 42.13,36.03 43.4,37.3 45.68,37.3 47.46,39.08 47.46,59.91 44.67,62.7 40.6,62.7 39.59,63.72 39.59,79.72 41.11,81.24 CMODS6.33
IO21
  Bottom 0.254: ESP.11 41.76,29.54 40.35,30.95 40.35,34.25 41.11,35.01 41.11,36.54 42.89,38.32 45.17,38.32 46.44,39.59 46.44,59.4 44.16,61.68 38.32,61.68 37.05,62.95 37.05,79.21 38.57,80.73 CMODS6.32
IO22
  Bottom 0.254: ESP.14 34.13,29.29 32.73,30.7 32.73,33.74 33.49,34.51 34,34.51 35.78,36.28 35.78,39.33 37.81,41.36 37.81,52.29 36.54,53.56 33.24,53.56 26.12,60.67 26.12,67.53 CMODS6.22
IO23
  Bottom 0.254: ESP.15 31.59,29.29 30.19,30.7 30.19,33.49 30.95,34.25 32.47,34.25 33.49,35.27 34,35.27 35.27,36.54 35.27,39.59 37.3,41.62 37.3,52.03 36.28,53.05 32.98,53.05 25.62,60.41 25.62,62.45 23.33,64.73 CMODS6.23
IO25
  Bottom 0.254: ESP.23 49.38,35.15 50,35.78 50,64.73 51.02,65.75 51.02,67.53 CMODS6.12
IO26
  Bottom 0.254: ESP.24 51.91,36.66 51.02,37.55 51.02,63.21 53.81,66 54.32,66 55.84,67.53 56.1,67.53 CMODS6.10
IO27
  Bottom 0.254: ESP.25 54.45,33.86 53.56,34.76 53.56,36.54 52.03,38.06 52.03,60.16 54.06,62.19 57.87,62.19 58.89,63.21 CMODS6.9
IO32
  Bottom 0.254: ESP.21 44.3,32.86 46.44,35.01 46.44,37.3 47.97,38.82 47.97,62.19 46.19,63.97 46.19,65.24 45.68,65.75 45.43,65.75 44.67,66.51 44.67,66.76 CMODS6.15
IO33
  Bottom 0.254: ESP.22 46.84,33.88 47.46,34.51 47.46,36.54 48.98,38.06 48.98,62.7 47.21,64.48 47.21,80.48 47.46,80.73 48.73,80.73 CMODS6.36
IO34
  Bottom 0.254: ESP.19 39.22,34.13 40.6,35.52 40.6,36.79 42.63,38.82 44.92,38.82 45.94,39.84 45.94,59.14 43.9,61.18 37.55,61.18 35.78,62.95 35.78,64.99 36.03,65.24 CMODS6.18
IO35
  Bottom 0.254: ESP.20 41.76,34.37 41.62,34.51 41.62,36.28 43.14,37.81 45.43,37.81 46.95,39.33 46.95,59.65 44.41,62.19 39.33,62.19 38.06,63.46 38.06,65.24 38.32,65.49 38.32,67.53 CMODS6.17
IO36
  Bottom 0.254: ESP.17 34.13,33.88 35.01,34.76 35.52,34.76 36.28,35.52 36.28,38.82 38.32,40.86 38.32,55.59 28.66,65.24 28.66,67.53 CMODS6.21
IO39
  Bottom 0.254: ESP.18 36.67,34.39 37.3,35.01 37.3,38.32 39.33,40.35 39.33,56.6 33.49,62.45 CMODS6.19
N$1
  Bottom 0.254: CMODS6.13 48.73,63.97 49.49,63.21 49.49,36.79 48.22,35.52 48.22,4.28 HALL.OUT
N$2
  Bottom 0.254: LEDS1.D4 71.08,96.99 60.16,86.07 57.87,86.07 IC1.8
N$3
  Bottom 0.254: LEDS1.D3 67.27,96.99 60.92,90.64 46.44,90.64 44.92,92.16 IC1.2
N$4
  Bottom 0.254: LEDS1.D2 63.97,95.47 59.65,91.15 50.76,91.15 50,91.91 IC1.4
N$5
  Bottom 0.254: LEDS1.D1 60.16,92.93 58.89,91.66 55.33,91.66 55.08,91.91 IC1.6
N$6
  Bottom 0.254: LEDS1.C4 LEDS1.C3 33.74,96.99 42.38,88.35 45.68,88.35 47.46,86.58 IC1.12
N$7
  Bottom 0.254: LEDS1.C2 LEDS1.C1 39.84,92.67 42.89,89.62 51.27,89.62 52.54,88.35 IC1.10
N$8  (via drill 0.4 pad 0.8)
  Top 0.254: LEDS2.D4 28.41,1.23 29.17,0.47 73.62,0.47 75.65,2.5 v75.65,6.82
  Bottom 0.254: v75.65,6.82 75.65,31.71 83.27,39.33 83.27,44.67 79.97,47.97 79.97,51.27 77.69,53.56 77.69,56.6 IC2.8
N$9  (via drill 0.4 pad 0.8)
  Top 0.254: LEDS2.D3 32.22,1.49 32.73,0.98 73.37,0.98 74.89,2.5 v74.89,7.58
  Bottom 0.254: v74.89,7.58 74.89,31.97 82.51,39.59 82.51,44.41 79.21,47.71 79.21,50 IC2.10
N$10  (via drill 0.4 pad 0.8)
  Top 0.254: LEDS2.D2 36.03,1.99 36.54,1.49 73.11,1.49 74.13,2.5 v74.13,6.82
  Bottom 0.254: v74.13,6.82 74.13,34.25 77.94,38.06 77.94,47.46 77.43,47.97 IC2.12
N$11  (via drill 0.4 pad 0.8)
  Top 0.254: LEDS2.D1 40.98,1.87 72.73,1.87 73.37,2.5 v73.37,7.58
  Bottom 0.254: v73.37,7.58 73.37,36.03 71.84,37.55 71.84,54.57 70.83,55.59 IC2.6
N$12  (via drill 0.4 pad 0.8)
  Top 0.254: LEDS2.C3 LEDS2.C4 v71.59,8.09
  Bottom 0.254: v71.59,8.09 71.59,36.79 71.34,37.05 71.34,49.24 70.07,50.51 IC2.4
N$13  (via drill 0.4 pad 0.8)
  Top 0.254: LEDS2.C1 LEDS2.C2 65.75,4.79 68.8,4.79 70.32,6.31 v70.32,8.09
  Bottom 0.254: v70.32,8.09 70.32,36.79 68.8,38.32 68.8,39.33 70.57,41.11 70.57,44.92 70.07,45.43 IC2.2
N$14
  Bottom 0.254: LEDS3.D4 96.74,28.41 85.05,40.09 IC3.8
N$15
  Bottom 0.254: LEDS3.D3 95.72,32.22 87.34,40.6 87.34,46.95 86.83,47.46 IC3.10
N$16
  Bottom 0.254: LEDS3.D2 94.7,36.03 89.37,41.36 89.37,43.9 90.64,45.17 92.42,45.17 IC3.6
N$17
  Bottom 0.254: LEDS3.D1 96.99,40.09 94.45,42.63 94.45,49.24 93.69,50 IC3.4
N$18
  Bottom 0.254: LEDS3.C4 LEDS3.C3 96.99,66.26 95.85,65.11 95.47,64.73 95.47,58.38 92.67,55.59 IC3.2
N$19
  Bottom 0.254: IC3.12 86.32,51.27 93.94,51.27 94.45,51.78 94.45,56.6 96.99,59.14 LEDS3.C1 LEDS3.C2
N$20
  Bottom 0.254: IC4.8 14.95,56.1 10.38,60.67 10.38,64.22 LEDS4.D4
N$21
  Bottom 0.254: IC4.6 9.11,54.83 9.11,58.38 4.53,62.95 4.53,66.26 LEDS4.D3
N$22
  Bottom 0.254: LEDS4.D2 3.01,63.21 5.8,60.41 5.8,48.48 6.31,47.97 IC4.4
N$23
  Bottom 0.254: LEDS4.D1 3.01,58.89 5.3,56.6 5.3,44.16 6.82,42.63 7.07,42.63 IC4.2
N$24
  Bottom 0.254: LEDS4.C4 LEDS4.C3 3.01,32.73 10.88,40.6 10.88,42.38 13.93,45.43 IC4.12
N$25
  Bottom 0.254: LEDS4.C2 LEDS4.C1 4.79,41.62 8.85,41.62 11.39,44.16 11.39,48.22 13.68,50.51 IC4.10
N$26
  Bottom 1.422: POWER_TEST.PWR 22.68,57.99 22.57,57.87 22.57,53.56 25.11,51.02 | 25.11,51.02 25.11,45.21 POWER.P | D1.A 25.36,51.27 25.11,51.02